# EAGLE schematic SmartCharger (EAGLE 9.6.2)
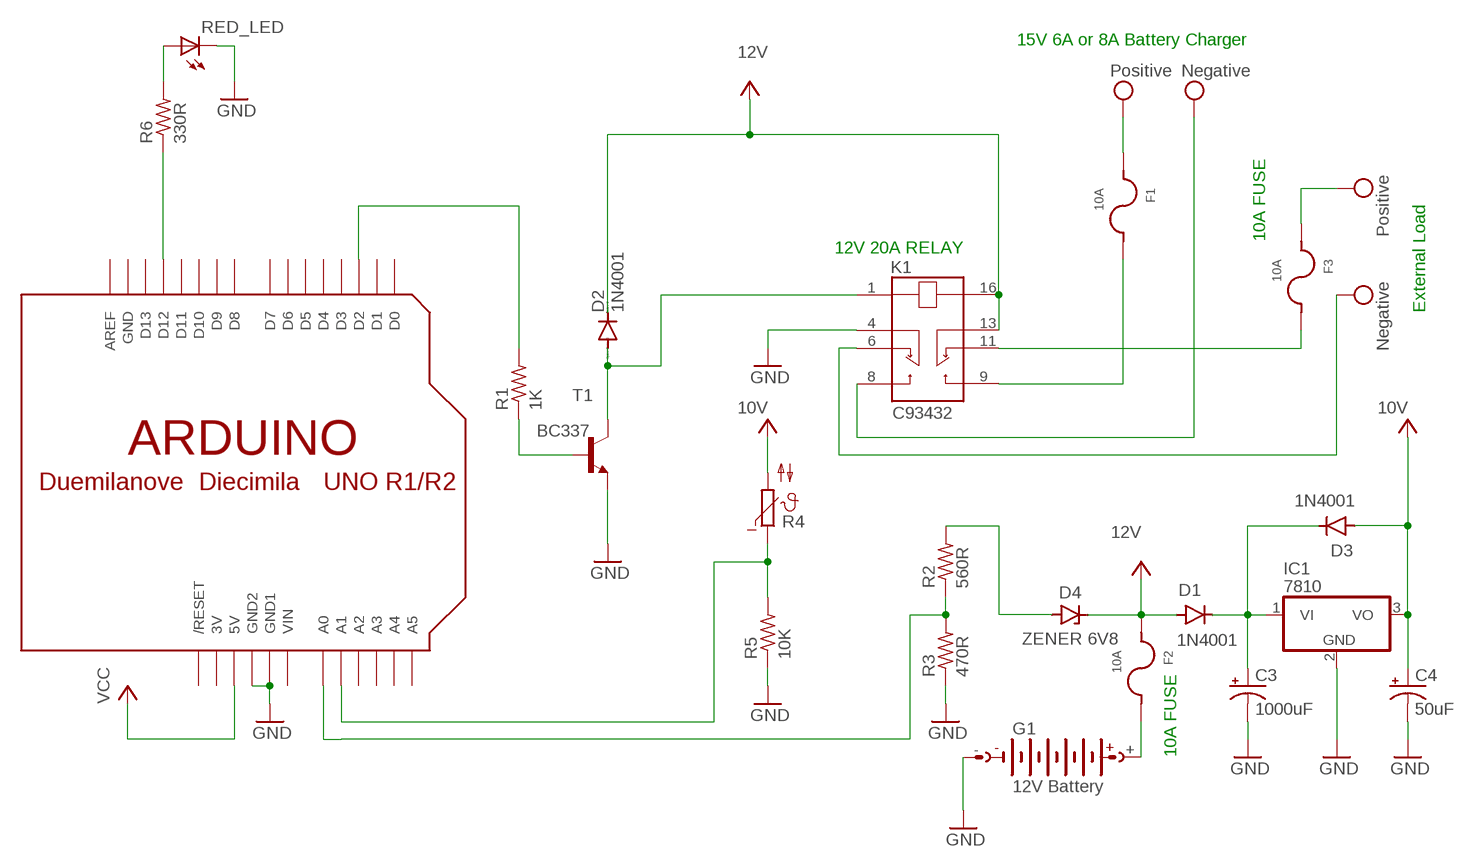
[diagram p0: schematic, sheet 1]

## Parts
C3  1000uF  C-POL-US_RADIAL-11MM-DIA  [CAPPRD508W65D1000H1100B]
C4  50uF  C-POL-US_RADIAL-11MM-DIA  [CAPPRD508W65D1000H1100B]
D1  1N4001  1N4004  [DO-41]
D2  1N4001  1N4148DO35-10  [DO35-10]
D3  1N4001  1N4004  [DO-41]
D4  ZENER 6V8  ZENER_DO-215-AC  [SOD6126X290]
F1  10A  01110501Z  [01110501Z]
F2  10A  01110501Z  [01110501Z]
F3  10A  01110501Z  [01110501Z]
G1  12V Battery  AB9V  [AB9V]
IC1  7810  7805TV  [TO220V]
K1  C93432  [C93432]
R1  1K  R-US_0207/12  [0207/12]
R2  560R  R-US_0207/12  [0207/12]
R3  470R  R-US_0207/12  [0207/12]
R4  NTC640  [P640]
R5  10K  R-US_0207/12  [0207/12]
R6  330R  R-US_0207/12  [0207/12]
RED_LED  LED5MM  [LED5MM]
T1  BC337  [TO92]
U$1  ARDUINOUNO  [ARDUINO]

## Nets
GND: C3.2(-) C4.2(-) G1.- IC1.2(GND) K1.4 R3.1 R5.1 RED_LED.K(C) T1.1(E) U$1.GND1 U$1.GND2
N$1: R1.2 U$1.D2
N$2: R1.1 T1.2(B)
N$3: F3.2 K1.11
N$4: F2.2 G1.+
N$6: R2.1 R3.2 U$1.A0
N$7: F1.2 K1.9
N$8: R4.1 R5.2 U$1.A1
N$9: C3.1(+) D1.C D3.C IC1.1(VI)
N$10: D2.A K1.1 T1.3(C)
N$12: R6.2 RED_LED.A
N$13: R6.1 U$1.D12
N$16: D4.2(A) R2.2
VCC: C4.1(+) D1.A D2.C D3.A D4.1(C) F1.1 F2.1 F3.1 IC1.3(VO) K1.6 K1.8 K1.13 K1.16 R4.2 U$1.5V ; supply symbol labelled 12V, Positive, Negative, 10V
Unconnected: U$1.A2 U$1.A3 U$1.A4 U$1.A5 U$1.AREF U$1.D0 U$1.D1 U$1.D3 U$1.D4 U$1.D5 U$1.D6 U$1.D7 U$1.D8 U$1.D9 U$1.D10 U$1.D11 U$1.D13 U$1.RESET(/RESET)

## Notes on the sheet
- 15V 6A or 8A Battery Charger
- 12V 20A RELAY | 10A FUSE
- External Load
- 10A FUSE

## Power pins joined to a net without a drawn wire
3V: U$1.3V
GND: U$1.GND
VIN: U$1.VIN

## Library data of the parts
C3 C4 = Capacitor:C-POL-US: Capacitor Polarised - ANSI; CATEGORY: Capacitor
D1 D3 = Diodes:1N4004: DIODE GEN PURP 400V 1A DO41 Manufacturer's datasheet <https://www.mccsemi.com/pdf/Products/1N4001-1N4007(DO-41).pdf>; CREATED_BY: PCBLayout.com; DIGIKEY_PART_NUMBER: 1N4004MSCT-ND; MANUFACTURER: Micro Commercial Co; MPN: 1N4004; PACKAGE: DO-41
D2 = diode:1N4148: DIODE high speed (Philips)
D4 = Diode:ZENER: Zener Diode - Generic; CATEGORY: Diode; SUB-CATEGORY: Zener; VALUE: ZENER
F1-F3 = Fuse Holder:01110501Z: FUSE CLIP CARTRIDGE 250V 10A PCB Manufacturer's datasheet <https://www.littelfuse.com/~/media/electronics/datasheets/fuse_clips/littelfuse_fuse_clip_111_datasheet.pdf.pdf>; CREATED_BY: PCBLayout.com; DIGIKEY_PN: F4189-ND; MANUFACTURER: Littelfuse Inc.; MPN: 01110501Z
G1 = battery:AB9V: 9-V BATTERY CLIP
IC1 = linear:78*: Positive VOLTAGE REGULATOR Source: http://cache.national.com/ds/LM/LM78L05.pdf http://www.fairchildsemi.com/ds/LM/LM7805.pdf
K1 = Relay:C93432: RELAY TELECOM DPDT 2A 12VDC Manufacturer's datasheet <https://www.te.com/commerce/DocumentDelivery/DDEController?Action=srchrtrv&DocNm=108-98006&DocType=SS&DocLang=EN>; CREATED_BY: PCBLayout.com; DIGIKEY_PARTNO: PB1642-ND; MANUFACTURER: TE Connectivity Potter & Brumfield Relays; MPN: C93432
R1-R3 R5 R6 = adafruit:R-US_: RESISTOR, American symbol
R4 = ptc-ntc:NTC640: PHILIPS NTC; OC_FARNELL: unknown; OC_NEWARK: unknown
RED_LED = adafruit:LED: LED OSRAM: - CHIPLED LG R971, LG N971, LY N971, LG Q971, LY Q971, LO R971, LY R971 LH N974, LH R974 LS Q976, LO Q976, LY Q976 LO Q996 - Hyper CHIPLED LW Q18S LB Q993, LB Q99A, LB R99A - SideLED LS A670, LO A670, LY A670, LG A670, LP A670 LB A673, LV A673, LT A673, LW A673 LH A674 LY A675 LS A676, LA A676, LO A676, LY A676, LW A676 LS A679, LY A679, LG A679 - Hyper Micro SIDELED® LS Y876, LA Y876, LO Y876, LY Y876 LT Y87S - SmartLED LW L88C, LW L88S LB L89C, LB L89S, LG L890 LS L89K, LO L89K, LY L89K LS L896, LA L896, LO L896, LY L896 - TOPLED LS T670, LO T670, LY T670, LG T670, LP T670 LSG T670, LSP T670, LSY T670, LOP T670, LYG T670 LG T671, LOG T671, LSG T671 LB T673, LV T673, LT T673, LW T673 LH T674 LS T676, LA T676, LO T676, LY T676, LB T676, LH T676, LSB T676, LW T676 LB T67C, LV T67C, LT T67C, LS T67K, LO T67K, LY T67K, LW E67C LS E67B, LA E67B, LO E67B, LY E67B, LB E67C, LV E67C, LT E67C LW T67C LS T679, LY T679, LG T679 LS T770, LO T770, LY T770, LG T770, LP T770 LB T773, LV T773, LT T773, LW T773 LH T774 LS E675, LA E675, LY E675, LS T675 LS T776, LA T776, LO T776, LY T776, LB T776 LHGB T686 LT T68C, LB T68C - Hyper Mini TOPLED® LB M676 - Mini TOPLED Santana® LG M470 LS M47K, LO M47K, LY M47K Source: http://www.osram.convergy.de/
T1 = transistor:BC337: NPN TRANSISTOR
U$1 = adafruit:ARDUINO: Arduino Diecimila/Duemilanove Make a shield with ease, this package has all the named pins as well as the two mounting drill holes and an outline of the USB and DC power connector. The outline is on the DIMENSION layer, so if your board house uses it they will cut the outline to match. http://www.ladyada.net/library/pcb/eaglelibrary.html